# EAGLE schematic schema0.1 (EAGLE 9.6.2)
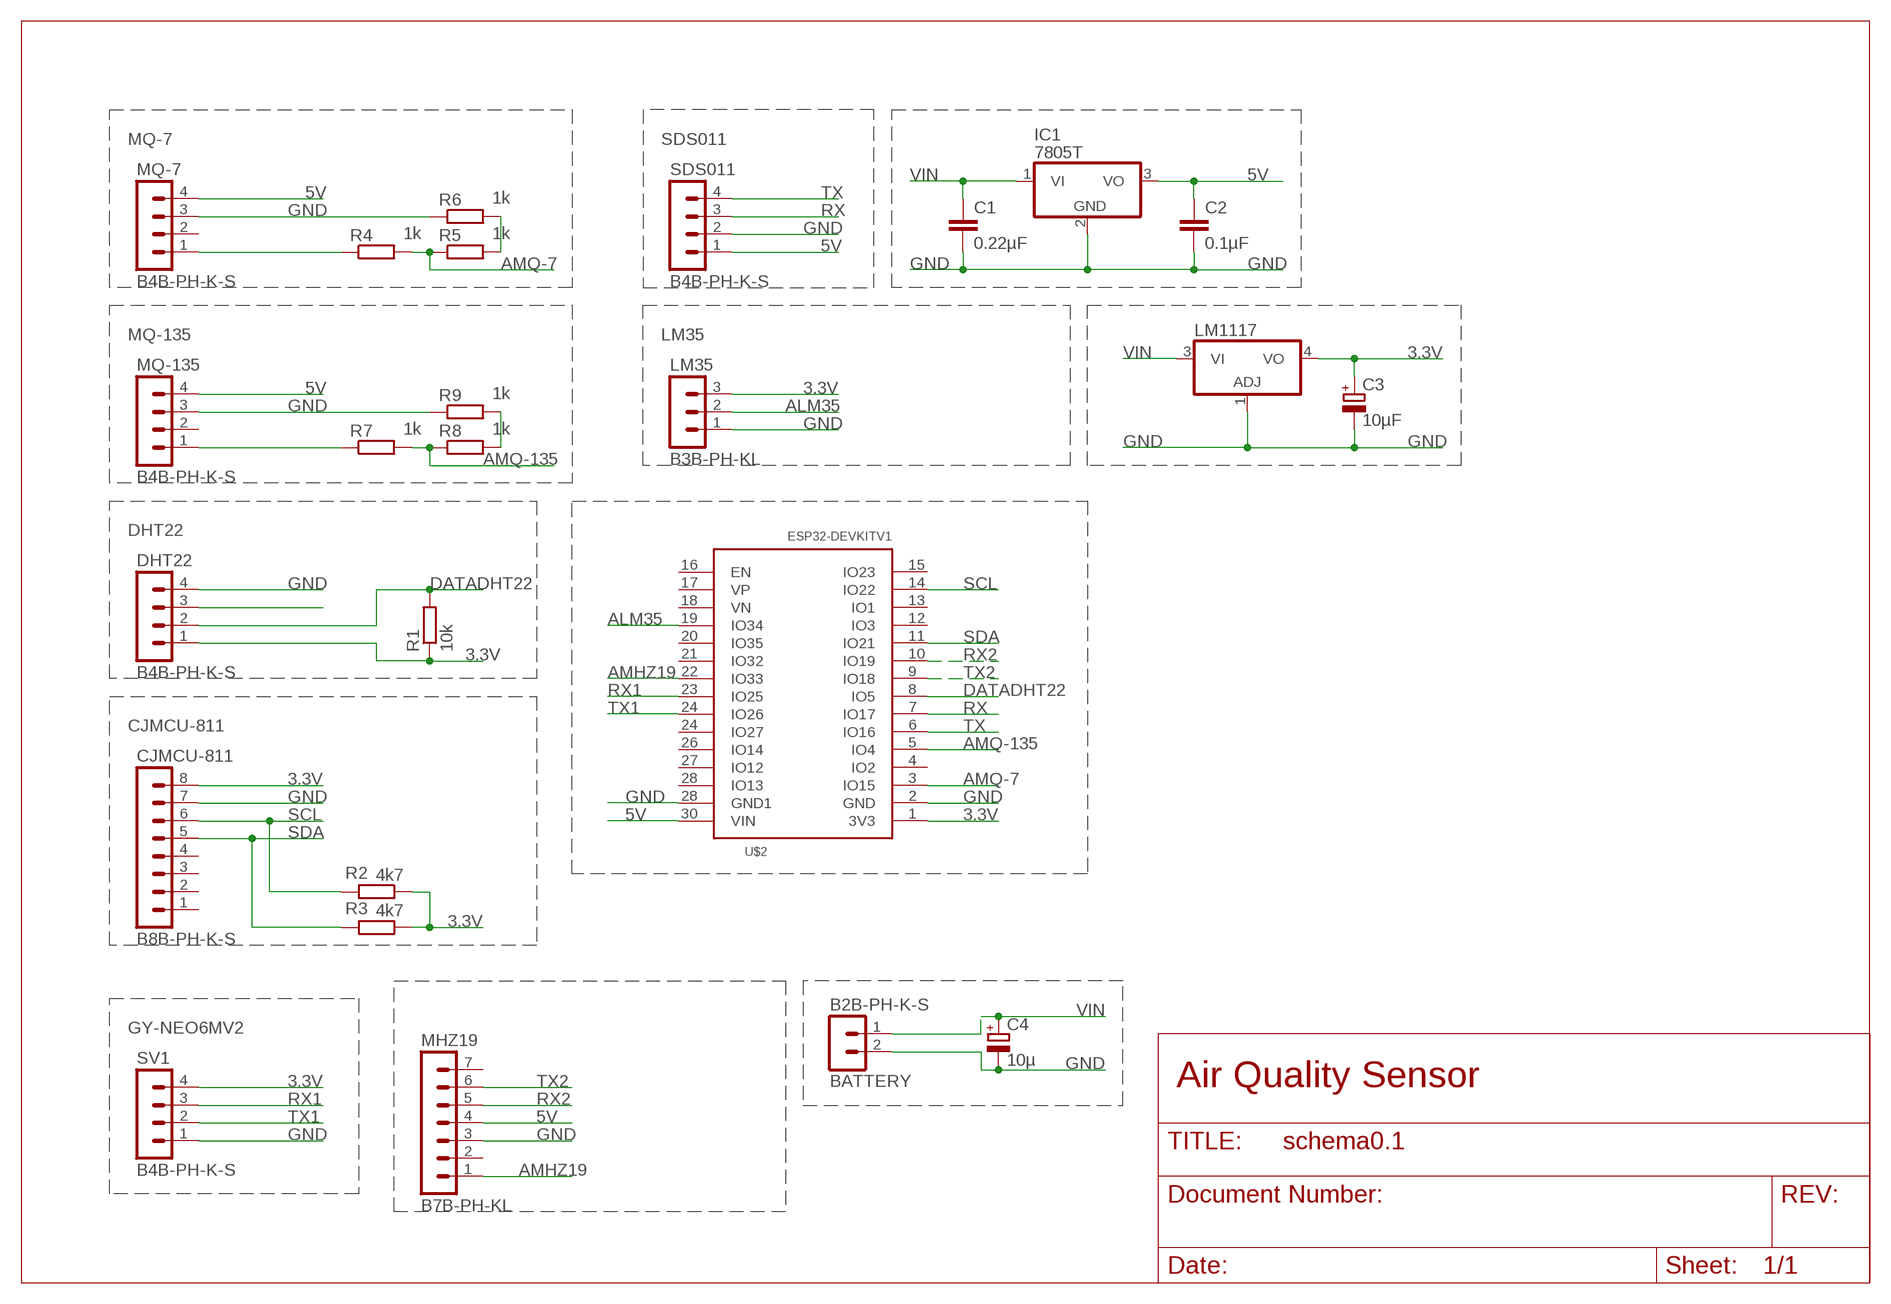
[diagram p0: schematic, sheet 1]

## Parts
BATTERY  B2B-PH-K-S  [B2B-PH-K-S]
C1  0.22µF  C-EUC0805  [C0805]
C2  0.1µF  C-EUC0805  [C0805]
C3  10µF  CPOL-EUE2-5  [E2-5]
C4  10µ  CPOL-EUE2-5  [E2-5]
CJMCU-811  B8B-PH-K-S  [B8B-PH-K-S]
DHT22  B4B-PH-K-S  [B4B-PH-K-S]
IC1  7805T  [TO220H]
LM35  B3B-PH-KL  [B3B-PH-K-S]
LM1117  317EMP  [SOT223]
MHZ19  B7B-PH-KL  [B7B-PH-K-S]
MQ-7  B4B-PH-K-S  [B4B-PH-K-S]
MQ-135  B4B-PH-K-S  [B4B-PH-K-S]
R1  10k  R-EU_R0805  [R0805]
R2  4k7  R-EU_R0805  [R0805]
R3  4k7  R-EU_R0805  [R0805]
R4  1k  R-EU_0207/10  [0207/10]
R5  1k  R-EU_R0805  [R0805]
R6  1k  R-EU_R0805  [R0805]
R7  1k  R-EU_R0805  [R0805]
R8  1k  R-EU_R0805  [R0805]
R9  1k  R-EU_R0805  [R0805]
SDS011  B4B-PH-K-S  [B4B-PH-K-S]
SV1  B4B-PH-K-S  [B4B-PH-K-S]
U$2  ESP32DEVKITV1  [ESP32-DEVKITV1]

## Nets
0: MQ-7.1 R4.1
1: MQ-135.1 R7.1
3.3V: C3.+ CJMCU-811.8 DHT22.1 LM35.3 LM1117.4(VO) R1.1 R2.1 R3.1 SV1.4 U$2.1(3V3)
5V: C2.1 IC1.3(VO) MHZ19.4 MQ-7.4 MQ-135.4 SDS011.1 U$2.30(VIN)
ALM35: LM35.2 U$2.19(IO34)
AMHZ19: MHZ19.1 U$2.22(IO33)
AMQ-7: R4.2 R5.1 U$2.3(IO15)
AMQ-135: R7.2 R8.1 U$2.5(IO4)
DATADHT22: DHT22.2 R1.2 U$2.8(IO5)
GND: BATTERY.2 C1.2 C2.2 C3.- C4.- CJMCU-811.7 DHT22.4 IC1.2(GND) LM35.1 LM1117.1(ADJ) MHZ19.3 MQ-7.3 MQ-135.3 R6.1 R9.1 SDS011.2 SV1.1 U$2.2(GND) U$2.28(GND1)
N$1: R8.2 R9.2
N$2: R5.2 R6.2
N$14: DHT22.3
RX: SDS011.3 U$2.7(IO17)
RX1: SV1.3 U$2.23(IO25)
RX2: MHZ19.5 U$2.10(IO19)
SCL: CJMCU-811.6 R2.2 U$2.14(IO22)
SDA: CJMCU-811.5 R3.2 U$2.11(IO21)
TX: SDS011.4 U$2.6(IO16)
TX1: SV1.2 U$2.24(IO26)
TX2: MHZ19.6 U$2.9(IO18)
VIN: BATTERY.1 C1.1 C4.+ IC1.1(VI) LM1117.3(VI)
Unconnected: CJMCU-811.1 CJMCU-811.2 CJMCU-811.3 CJMCU-811.4 MHZ19.2 MHZ19.7 MQ-7.2 MQ-135.2 U$2.4(IO2) U$2.12(IO3) U$2.13(IO1) U$2.15(IO23) U$2.16(EN) U$2.17(VP) U$2.18(VN) U$2.20(IO35) U$2.21(IO32) U$2.24(IO27) U$2.26(IO14) U$2.27(IO12) U$2.28(IO13)

## Notes on the sheet
- MQ-7 | SDS011
- MQ-135 | LM35
- DHT22
- CJMCU-811
- GY-NEO6MV2
- Air Quality Sensor

## Library data of the parts
BATTERY = con-JST PH:B2B-PH: JST PH series header 2.00mm pitch disconnectable crimp style connectors, vertical (side entry type), 2 pins
C1 C2 = rcl:C-EU: CAPACITOR, European symbol; SPICEPREFIX: C
C3 C4 = rcl:CPOL-EU: POLARIZED CAPACITOR, European symbol; SPICEPREFIX: C
CJMCU-811 = con-JST PH:B8B-PH: JST PH series header 2.00mm pitch disconnectable crimp style connectors, vertical (side entry type), 8 pins
DHT22 MQ-7 MQ-135 SDS011 SV1 = con-JST PH:B4B-PH: JST PH series header 2.00mm pitch disconnectable crimp style connectors, vertical (side entry type), 4 pins
IC1 = adafruit:78*: Positive VOLTAGE REGULATOR Added bigger pads to the TO-92 package
LM35 = con-JST PH:B3B-PH: JST PH series header 2.00mm pitch disconnectable crimp style connectors, vertical (side entry type), 3 pins
LM1117 = linear:*317: Positive VOLTAGE REGULATOR
MHZ19 = con-JST PH:B7B-PH: JST PH series header 2.00mm pitch disconnectable crimp style connectors, vertical (side entry type), 7 pins
R1-R9 = rcl:R-EU_: RESISTOR, European symbol; SPICEPREFIX: R
U$2 = ESP32-DEVKITV1:ESP32DEVKITV1